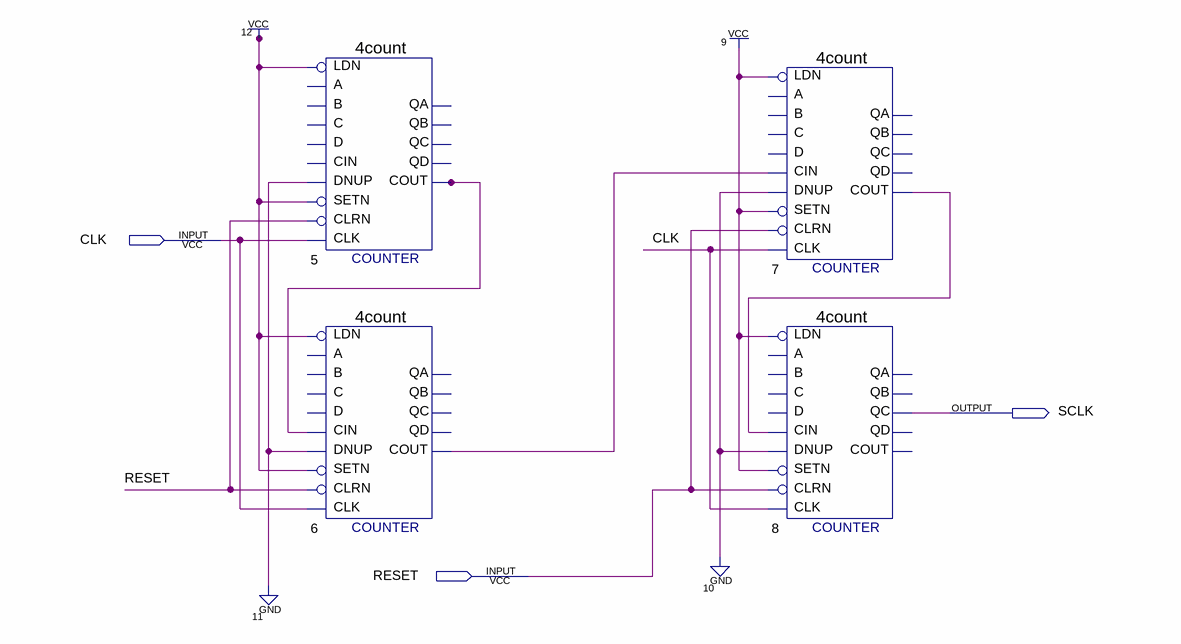
[diagram p0: schematic sheet]
// Quartus schematic clkdivide.bdf as structural Verilog: 4 symbols, 3 pins
module clkdivide (
  input  CLK,
  input  RESET,
  output SCLK
);

  wire n5_cout, n6_cout, n7_cout;

  \4count  u_5 (
    .LDN(1'b1), .DNUP(1'b0), .SETN(1'b1), .CLK(CLK), .CLRN(RESET), .COUT(n5_cout));  // open: B, A, CIN, D, C, QA, QD, QC, QB
  \4count  u_6 (
    .LDN(1'b1), .DNUP(1'b0), .CIN(n5_cout), .SETN(1'b1), .CLK(CLK), .CLRN(RESET), .COUT(n6_cout));  // open: B, A, D, C, QA, QD, QC, QB
  \4count  u_7 (
    .LDN(1'b1), .DNUP(1'b0), .CIN(n6_cout), .SETN(1'b1), .CLK(CLK), .CLRN(RESET), .COUT(n7_cout));  // open: B, A, D, C, QA, QD, QC, QB
  \4count  u_8 (
    .LDN(1'b1), .DNUP(1'b0), .CIN(n7_cout), .SETN(1'b1), .CLK(CLK), .CLRN(RESET), .QC(SCLK));  // open: B, A, D, C, QA, QD, QB, COUT
endmodule
